# Altium schematic sheet Montecarlo.SchDoc
size A4
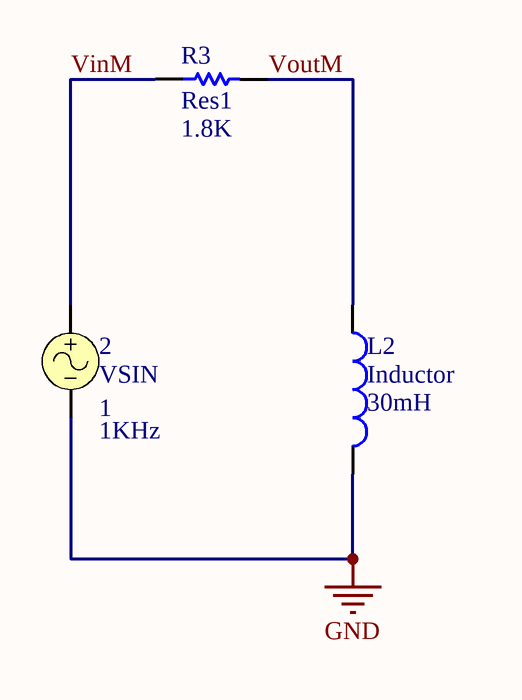
[diagram p0: Montecarlo.SchDoc]

## Parts
2  VSIN  Amplitude: 1  Frequency: 1KHz
L2  Inductor  value 30mH  [0402-A]
R3  Res1  value 1.8K  [AXIAL-0.3]

## Nets
GND: 2.2 L2.2
VinM: 2.1 R3.1
VoutM: L2.1 R3.2

## Library data of the parts
2 = VSIN: Sinusoidal Voltage Source; Note: PCB Footprint - Not required; Published: 8-Jun-2000; LatestRevisionDate: 15-Nov-2004; LatestRevisionNote: Corrected Netlist.; PackageReference: Not Applicable; Publisher: Altium Limited
L2 = Inductor: Code_IEC: 1005; Published: 8-Jun-2000; LatestRevisionDate: 29-May-2009; LatestRevisionNote: IPC-7351 Footprint Added.; PackageReference: 0402-A; Publisher: Altium Limited; PackageDescription: Chip Inductor; Code_JEITA: 0402
R3 = Res1: Resistor; Published: 8-Jun-2000; LatestRevisionDate: 17-Jul-2002; LatestRevisionNote: Re-released for DXP Platform.; PackageReference: AXIAL-0.3; Publisher: Altium Limited; PackageDescription: Axial Device, Thru-Hole; 2 Leads; 0.3 in Pin Spacing